# Altium schematic sheet MK32_3.SchDoc
size 420 x 297 mm; DocumentNumber: Э.5161.01.00.00Э3; SheetNumber: 3
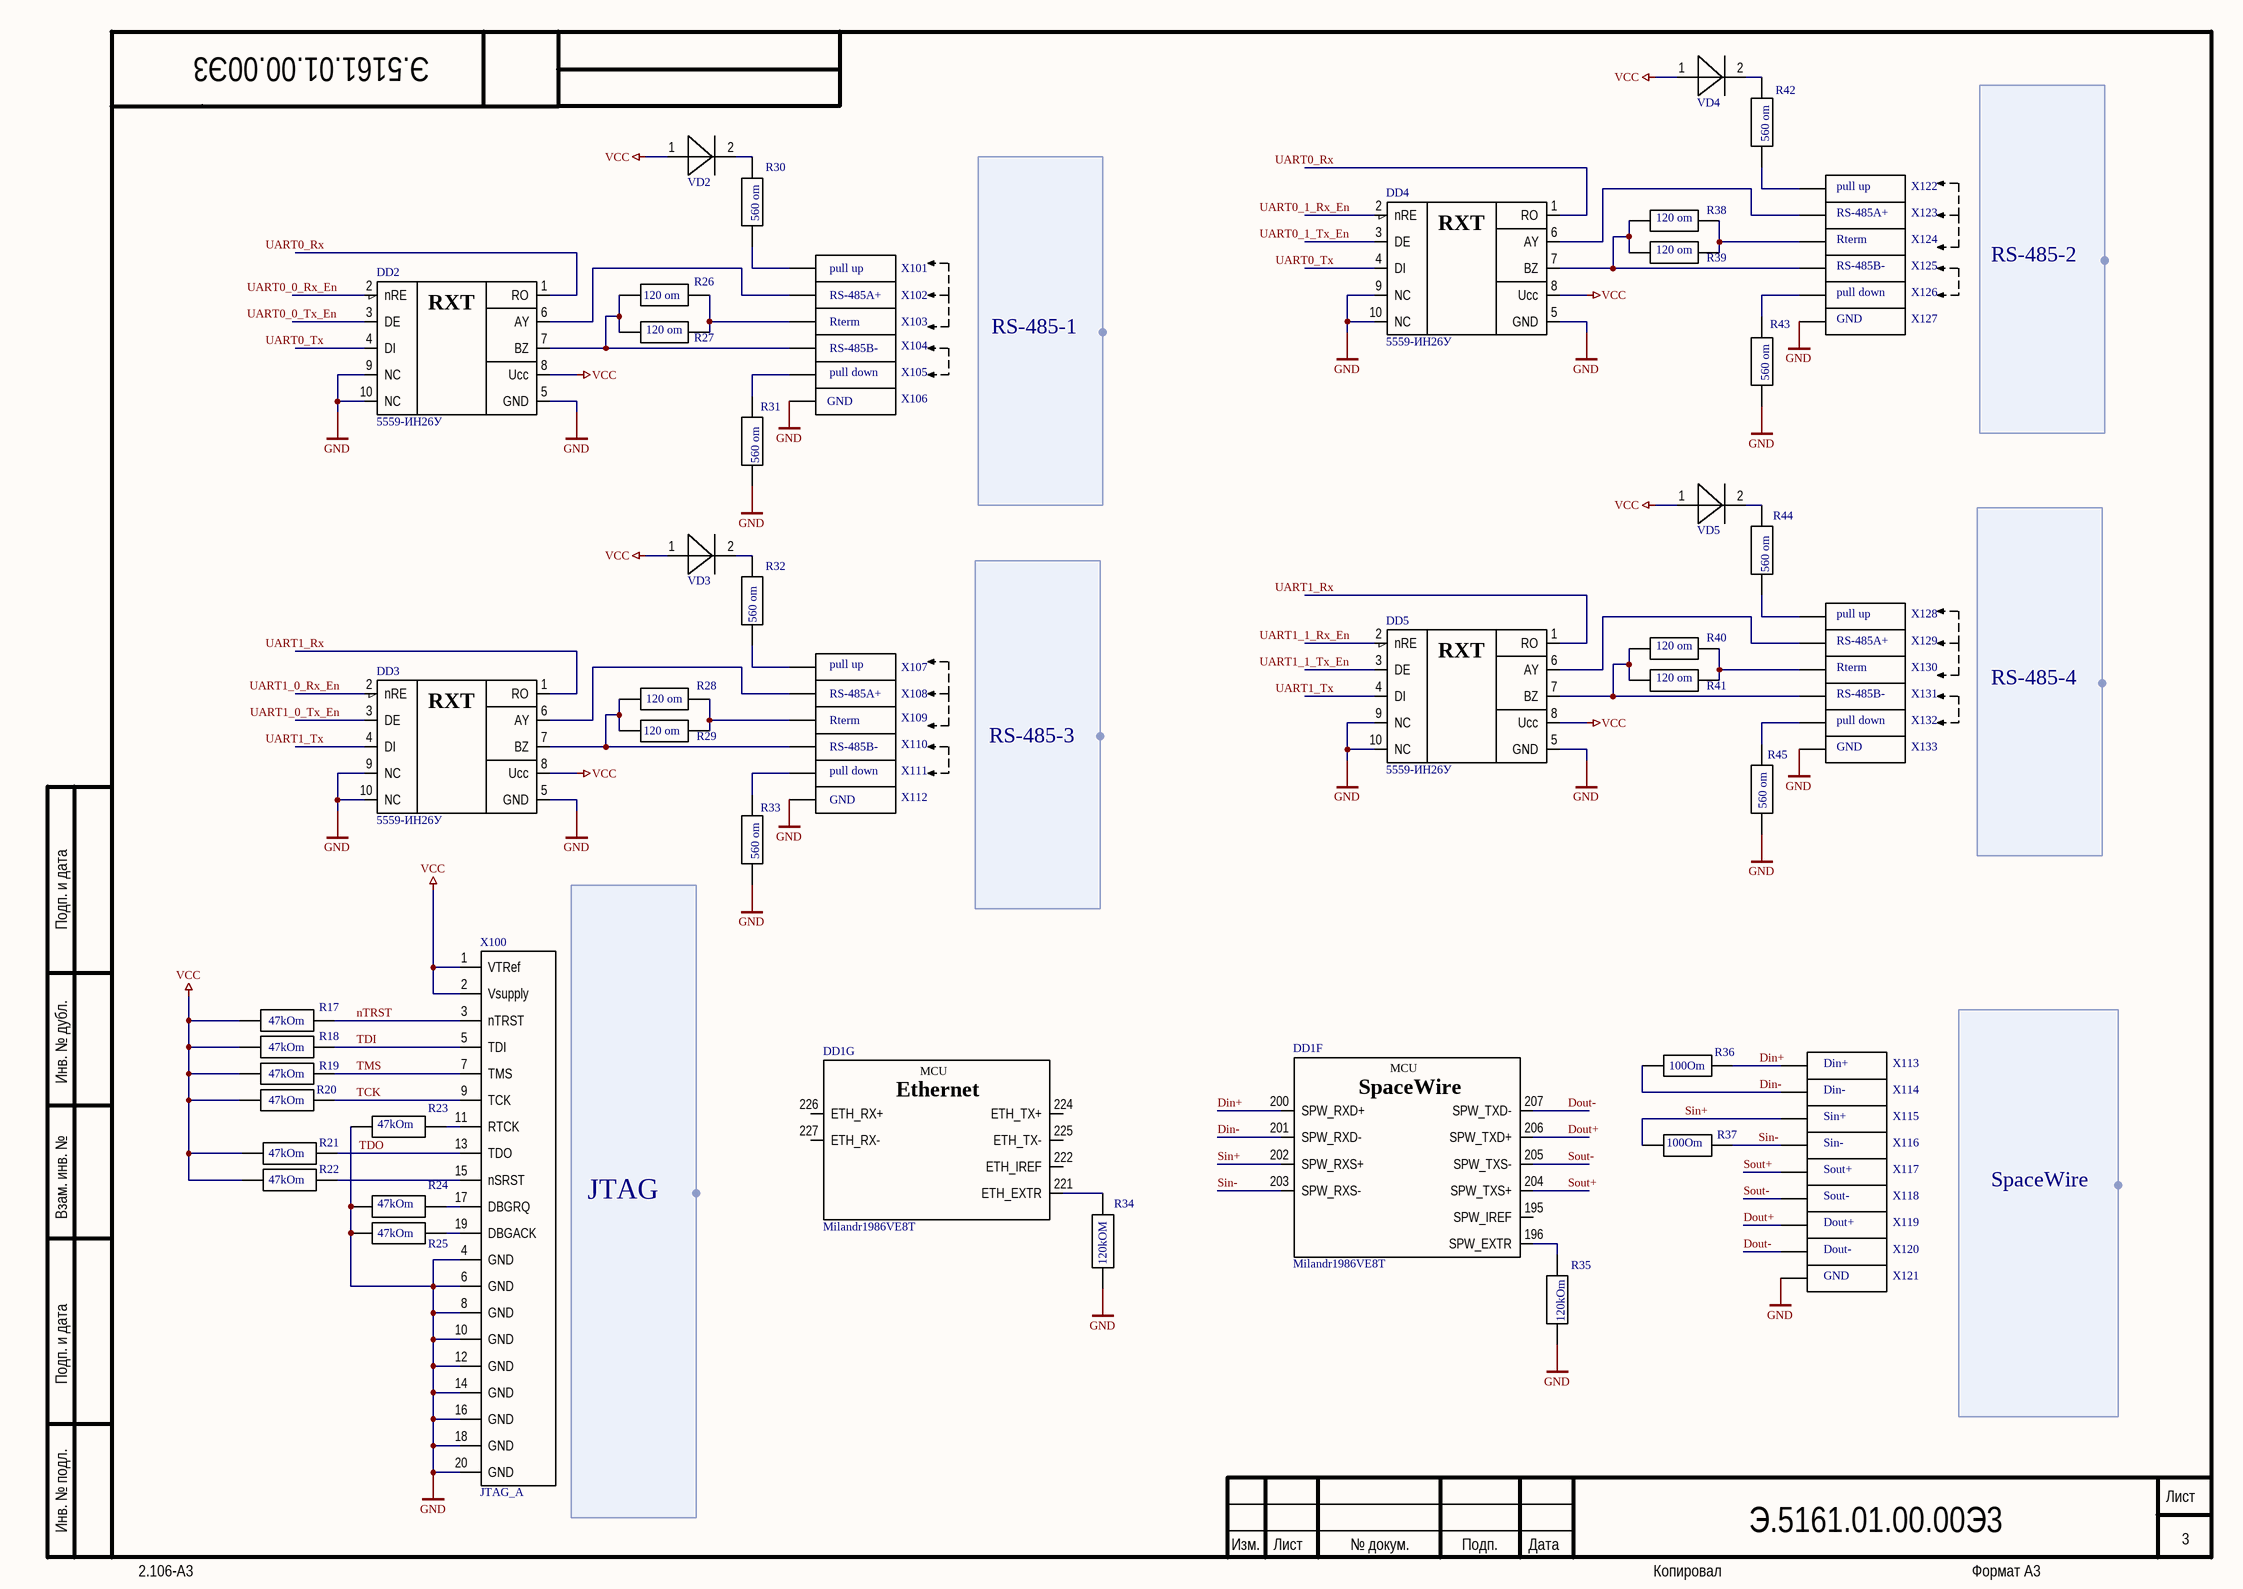
[diagram p0: MK32_3.SchDoc]

## Parts
(Parts that share a designator on the sheet are numbered #1, #2 ... from top to bottom, then left to right.)
DD1#1  Milandr1986VE8T  [4244.256-3]  (part G of 8)
DD1#2  Milandr1986VE8T  [4244.256-3]  (part F of 6)
DD2  5559-ИН26У  [H02.2-1-B]
DD3  5559-ИН26У  [H02.2-1-B]
DD4  5559-ИН26У  [H02.2-1-B]
DD5  5559-ИН26У  [H02.2-1-B]
R17  47kOm  [C 0603]
R18  47kOm  [C 0603]
R19  47kOm  [C 0603]
R20  47kOm  [C 0603]
R21  47kOm  [C 0603]
R22  47kOm  [C 0603]
R23  47kOm  [C 0603]
R24  47kOm  [C 0603]
R25  47kOm  [C 0603]
R26  120 om  [R1206]
R27  120 om  [R1206]
R28  120 om  [R1206]
R29  120 om  [R1206]
R30  560 om  [R1206]
R31  560 om  [R1206]
R32  560 om  [R1206]
R33  560 om  [R1206]
R34  120kOM  [C 0603]
R35  120kOm  [C 0603]
R36  100Om  [C 0603]
R37  100Om  [C 0603]
R38  120 om  [R1206]
R39  120 om  [R1206]
R40  120 om  [R1206]
R41  120 om  [R1206]
R42  560 om  [R1206]
R43  560 om  [R1206]
R44  560 om  [R1206]
R45  560 om  [R1206]
VD2  2Д510А  [2Д510А]  (value not drawn)
VD3  2Д510А  [2Д510А]  (value not drawn)
VD4  2Д510А  [2Д510А]  (value not drawn)
VD5  2Д510А  [2Д510А]  (value not drawn)
X100  JTAG_A  [IDC-20]
X101  pull up  [PL]
X102  RS-485A+  [PL]
X103  Rterm  [PL]
X104  RS-485B-  [PL]
X105  pull down  [PL]
X106  GND  [PL]
X107  pull up  [PL]
X108  RS-485A+  [PL]
X109  Rterm  [PL]
X110  RS-485B-  [PL]
X111  pull down  [PL]
X112  GND  [PL]
X113  Din+  [PL]
X114  Din-  [PL]
X115  Sin+  [PL]
X116  Sin-  [PL]
X117  Sout+  [PL]
X118  Sout-  [PL]
X119  Dout+  [PL]
X120  Dout-  [PL]
X121  GND  [PL]
X122  pull up  [PL]
X123  RS-485A+  [PL]
X124  Rterm  [PL]
X125  RS-485B-  [PL]
X126  pull down  [PL]
X127  GND  [PL]
X128  pull up  [PL]
X129  RS-485A+  [PL]
X130  Rterm  [PL]
X131  RS-485B-  [PL]
X132  pull down  [PL]
X133  GND  [PL]

## Harnesses
RS-485-2: 
RS-485-4: 
RS-485-1: 
RS-485-3: 
JTAG: 
SpaceWire: 

## Nets
GND: DD2.5(GND) DD2.9(NC) DD2.10(NC) DD3.5(GND) DD3.9(NC) DD3.10(NC) DD4.5(GND) DD4.9(NC) DD4.10(NC) DD5.5(GND) DD5.9(NC) DD5.10(NC) R23.1 R24.1 R25.1 R31.2 R33.2 R34.2 R35.1 R43.2 R45.2 X100.4(GND) X100.6(GND) X100.8(GND) X100.10(GND) X100.12(GND) X100.14(GND) X100.16(GND) X100.18(GND) X100.20(GND) X106.?1(name) X112.?1(name) X121.?1(name) X127.?1(name) X133.?1(name)
VCC: DD2.8(Ucc) DD3.8(Ucc) DD4.8(Ucc) DD5.8(Ucc) R17.2 R18.2 R19.2 R20.2 R21.2 R22.2 VD2.1 VD3.1 VD4.1 VD5.1 X100.1(VTRef) X100.2(Vsupply)
Din+: DD1#2.200(SPW_RXD+) R36.2 X113.?1(name)
Din-: DD1#2.201(SPW_RXD-) R36.1 X114.?1(name)
Dout+: DD1#2.206(SPW_TXD+) X119.?1(name)
Dout-: DD1#2.207(SPW_TXD-) X120.?1(name)
nTRST: R17.1 X100.3(nTRST)
Sin+: DD1#2.202(SPW_RXS+) R37.1 X115.?1(name)
Sin-: DD1#2.203(SPW_RXS-) R37.2 X116.?1(name)
Sout+: DD1#2.204(SPW_TXS+) X117.?1(name)
Sout-: DD1#2.205(SPW_TXS-) X118.?1(name)
TCK: R20.1 X100.9(TCK)
TDI: R18.1 X100.5(TDI)
TDO: R21.1 X100.13(TDO)
TMS: R19.1 X100.7(TMS)
UART0_0_Rx_En: DD2.2(nRE)
UART0_0_Tx_En: DD2.3(DE)
UART0_1_Rx_En: DD4.2(nRE)
UART0_1_Tx_En: DD4.3(DE)
UART0_Rx: DD2.1(RO) DD4.1(RO)
UART0_Tx: DD2.4(DI) DD4.4(DI)
UART1_0_Rx_En: DD3.2(nRE)
UART1_0_Tx_En: DD3.3(DE)
UART1_1_Rx_En: DD5.2(nRE)
UART1_1_Tx_En: DD5.3(DE)
UART1_Rx: DD3.1(RO) DD5.1(RO)
UART1_Tx: DD3.4(DI) DD5.4(DI)
NetDD1#1_221: DD1#1.221(ETH_EXTR) R34.1
NetDD1#2_196: DD1#2.196(SPW_EXTR) R35.2
NetDD2_6: DD2.6(AY) X102.?1(name)
NetDD2_7: DD2.7(BZ) R26.2 R27.2 X104.?1(name)
NetDD3_6: DD3.6(AY) X108.?1(name)
NetDD3_7: DD3.7(BZ) R28.2 R29.2 X110.?1(name)
NetDD4_6: DD4.6(AY) X123.?1(name)
NetDD4_7: DD4.7(BZ) R38.2 R39.2 X125.?1(name)
NetDD5_6: DD5.6(AY) X129.?1(name)
NetDD5_7: DD5.7(BZ) R40.2 R41.2 X131.?1(name)
NetR22_1: R22.1 X100.15(nSRST)
NetR23_2: R23.2 X100.11(RTCK)
NetR24_2: R24.2 X100.17(DBGRQ)
NetR25_2: R25.2 X100.19(DBGACK)
NetR26_1: R26.1 R27.1 X103.?1(name)
NetR28_1: R28.1 R29.1 X109.?1(name)
NetR30_1: R30.1 VD2.2
NetR30_2: R30.2 X101.?1(name)
NetR31_1: R31.1 X105.?1(name)
NetR32_1: R32.1 VD3.2
NetR32_2: R32.2 X107.?1(name)
NetR33_1: R33.1 X111.?1(name)
NetR38_1: R38.1 R39.1 X124.?1(name)
NetR40_1: R40.1 R41.1 X130.?1(name)
NetR42_1: R42.1 VD4.2
NetR42_2: R42.2 X122.?1(name)
NetR43_1: R43.1 X126.?1(name)
NetR44_1: R44.1 VD5.2
NetR44_2: R44.2 X128.?1(name)
NetR45_1: R45.1 X132.?1(name)

Not connected (* = marked no-connect by the designer): DD1#1 222(ETH_IREF) 224(ETH_TX+) 225(ETH_TX-) 226(ETH_RX+) 227(ETH_RX-); DD1#2 195(SPW_IREF)

## Notes on the sheet
- Подп. и дата
- Инв. № дубл.
- Взам. инв. №
- Инв. № подл.
- Изм.
- Лист
- № докум.
- Подп.
- Дата
- 2.106-A3
- Копировал
- Формат А3
- (in symbol 5559-ИН26У) RXT
- (in symbol Milandr1986VE8T, part F) MCU; SpaceWire
- (in symbol Milandr1986VE8T, part G) MCU; Ethernet

## Library data of the parts
R17-R25 R34-R37 = R0603
R26-R33 R38-R45 = R1206
X100 = IDC-20
X101-X133 = PL
DD1#1 DD1#2 = Milandr1986VE8T: Parameter 1: *